# EAGLE schematic sinobit (EAGLE 6.1)
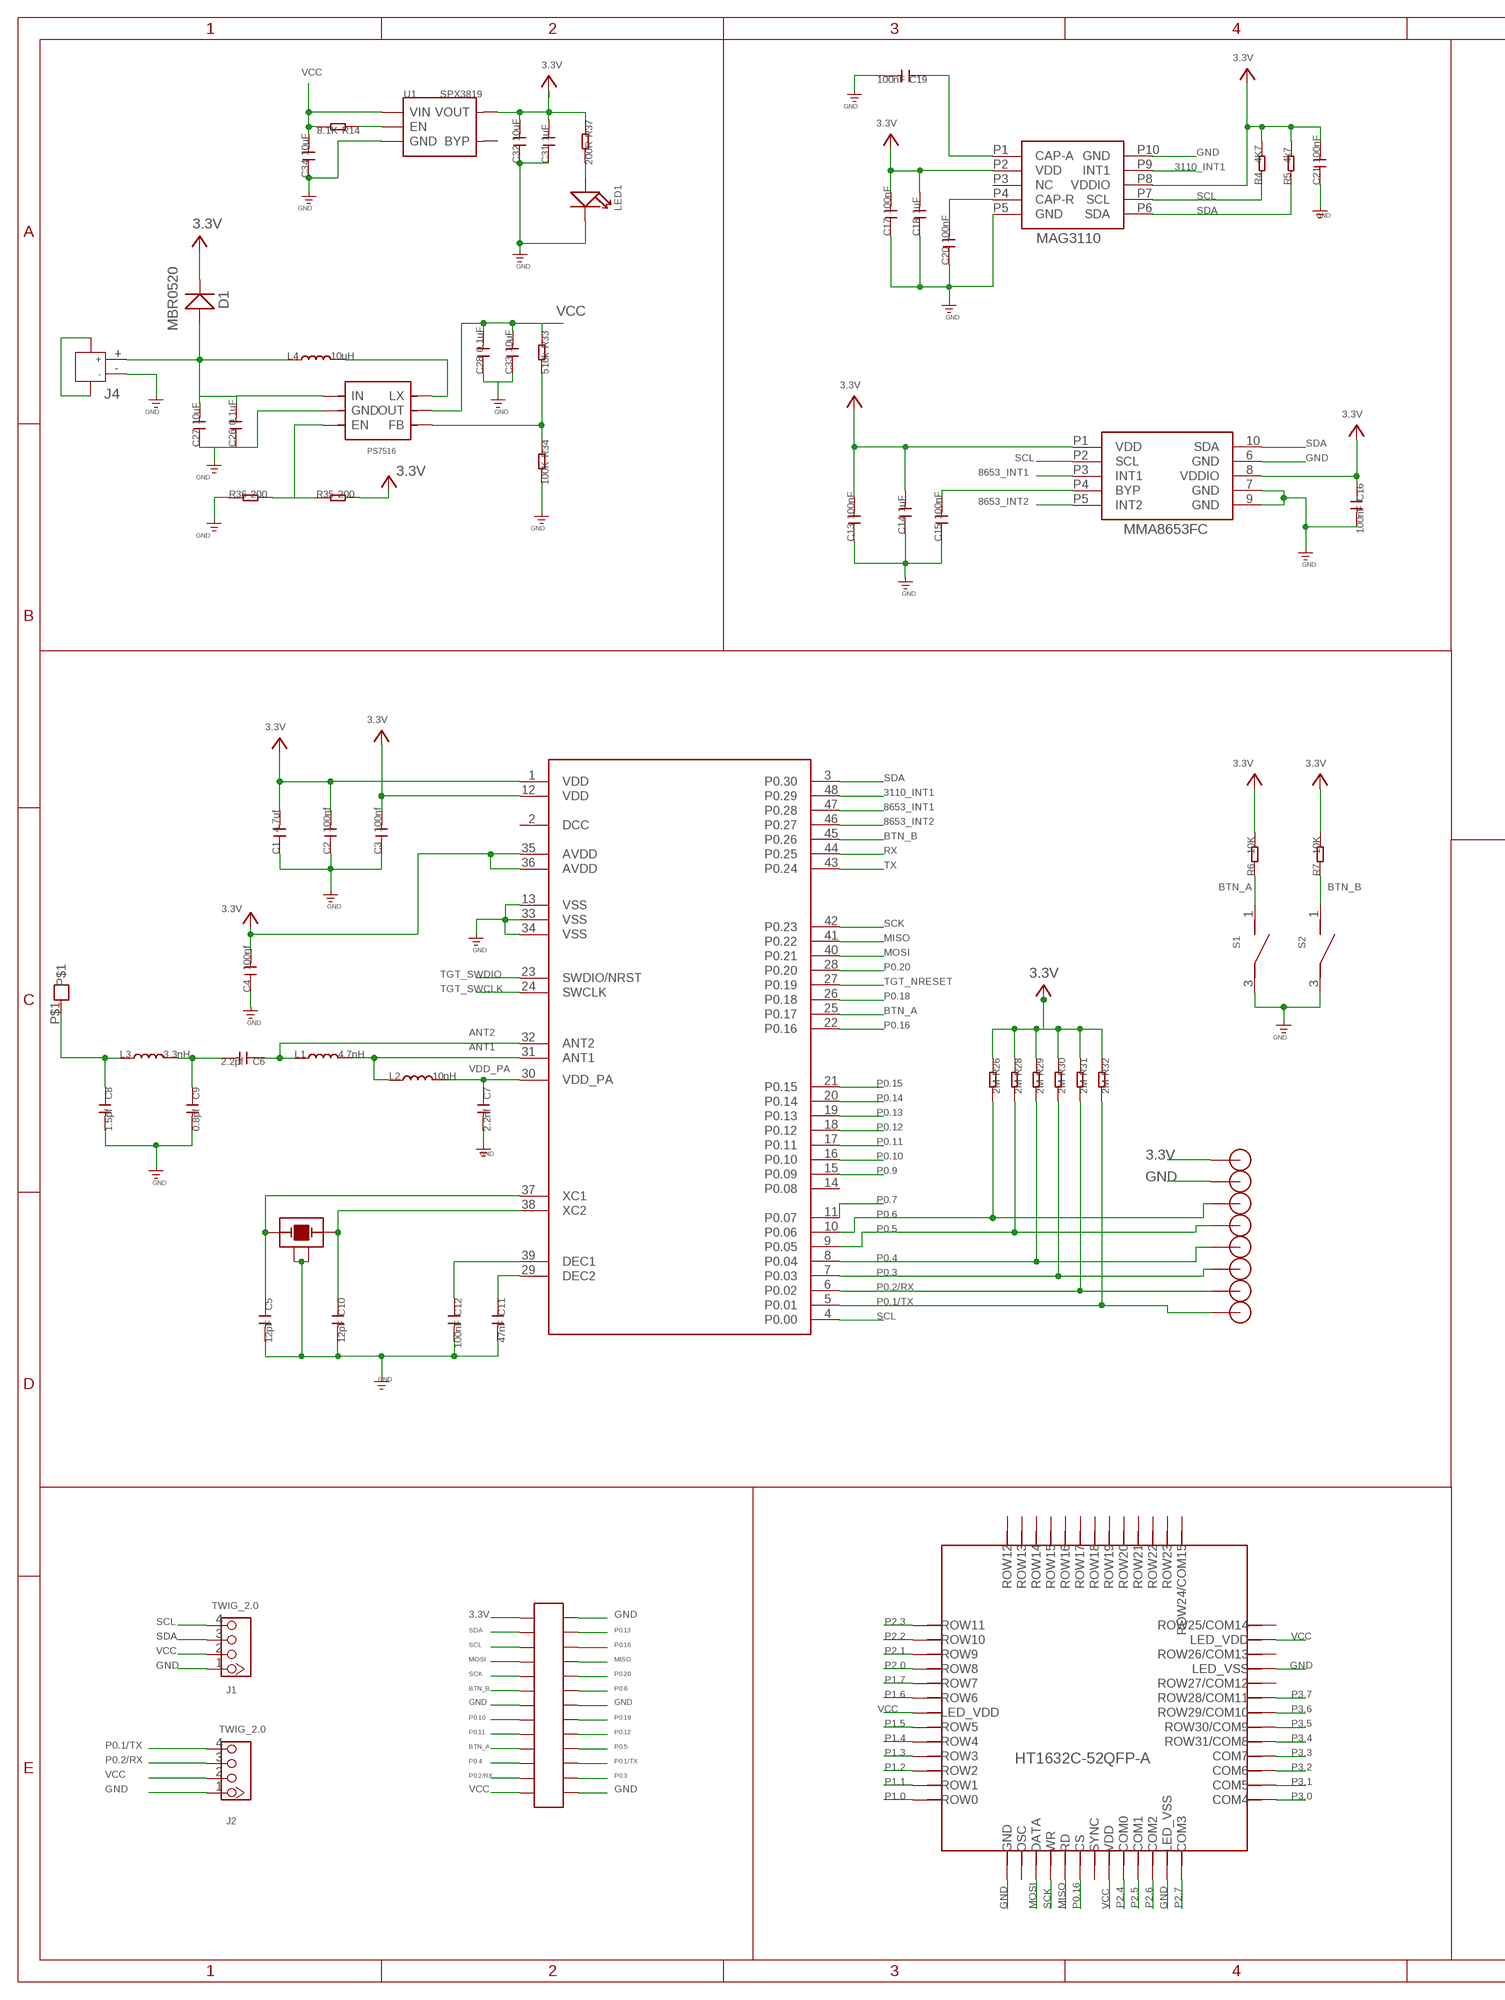
[diagram p0: schematic, sheet 1, part 1 of 2]
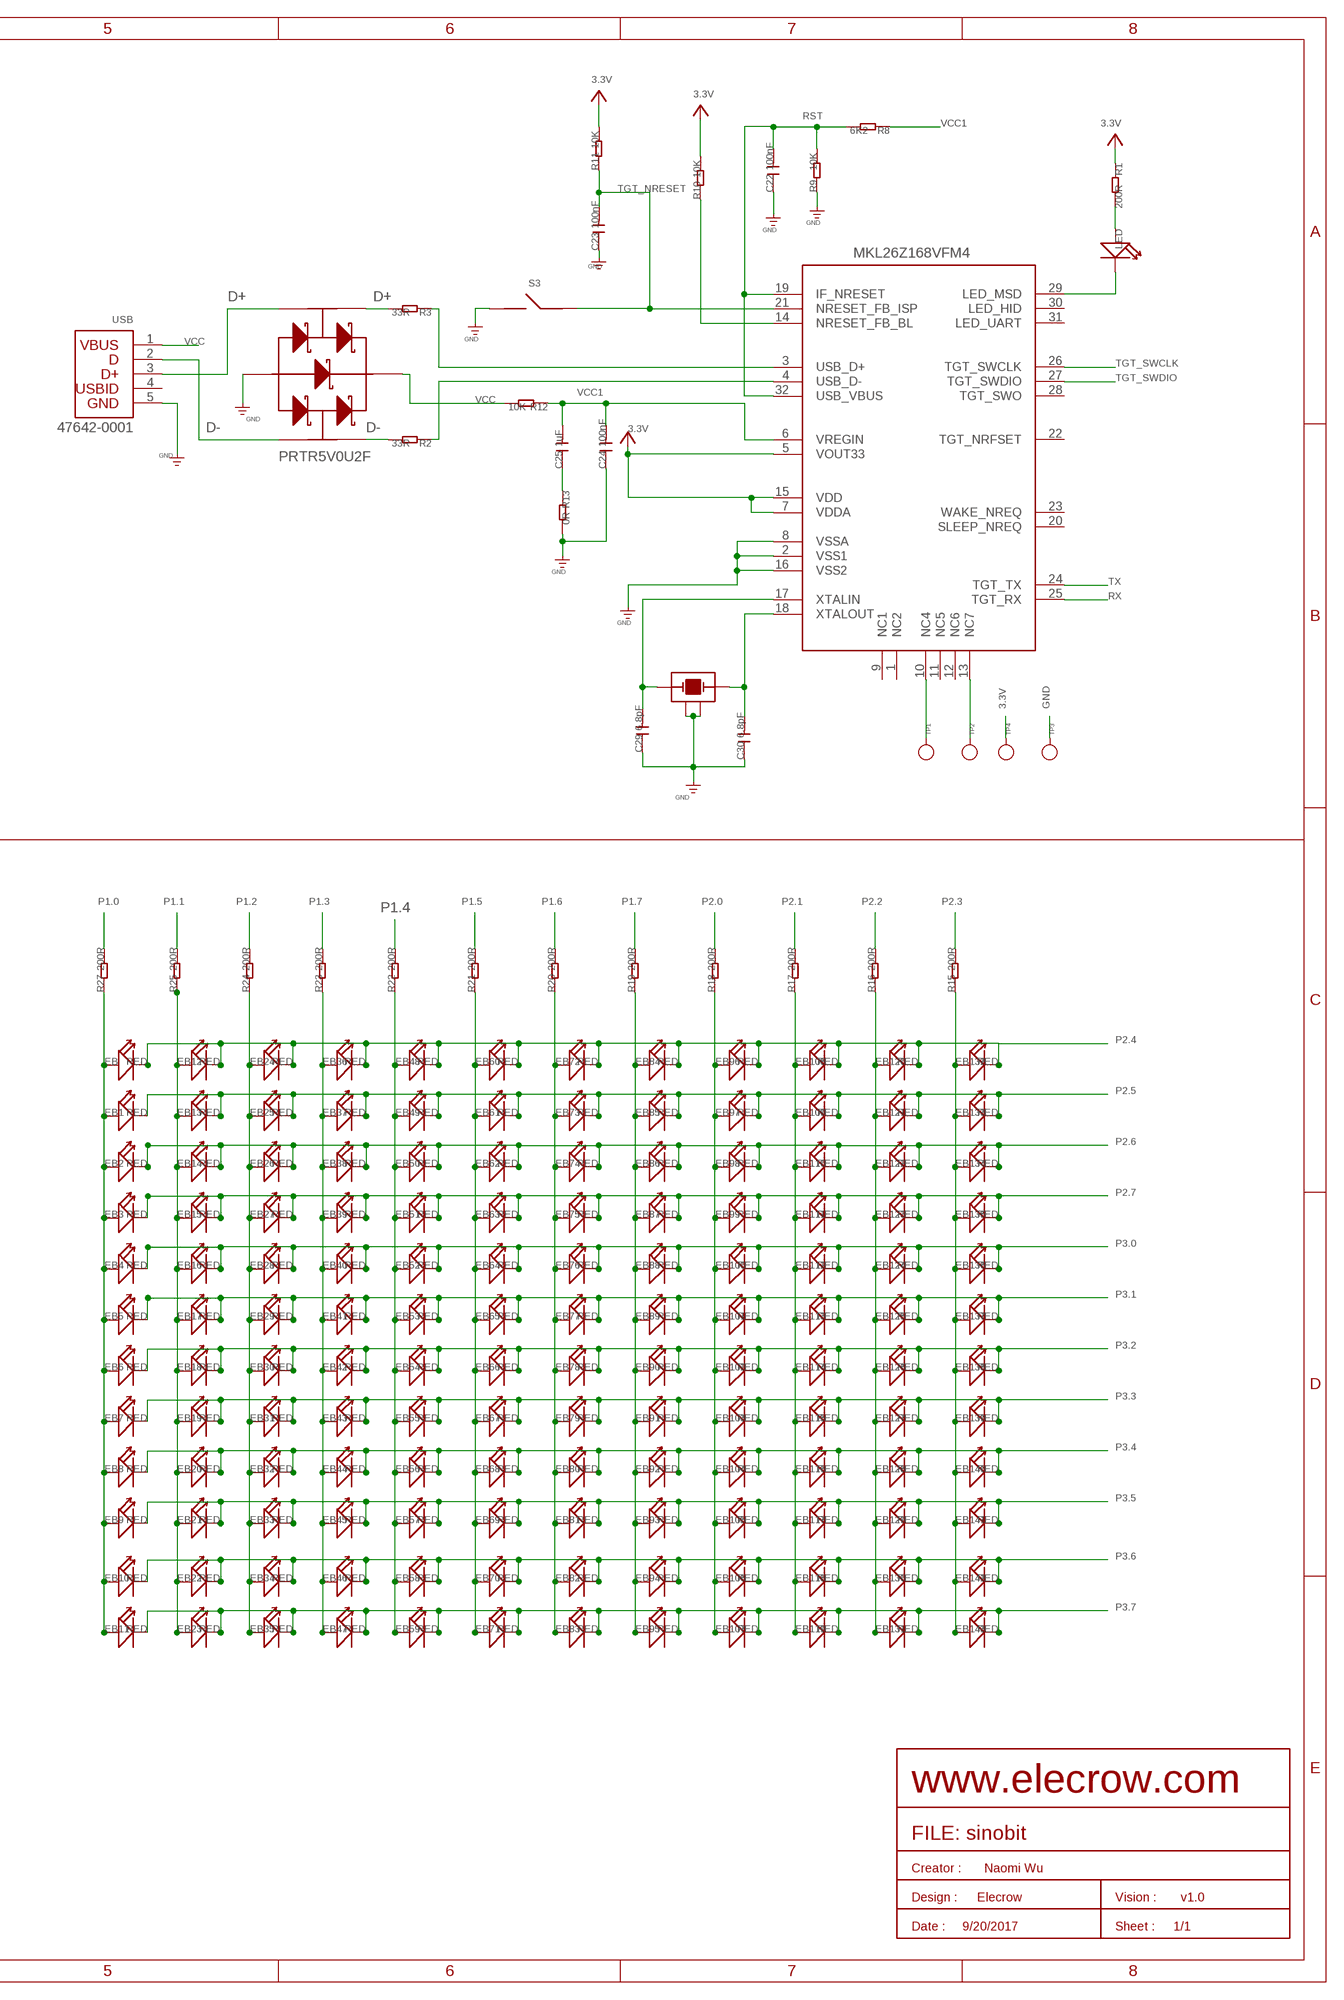
[diagram p1: schematic, sheet 1, part 2 of 2]

## Parts
C1  4.7uf  C-0402  [C0402]
C2  100nf  C-0402  [C0402]
C3  100nf  C-0402  [C0402]
C4  100nf  C-0402  [C0402]
C5  12pF  C-0402  [C0402]
C6  2.2pf  C-0402  [C0402]
C7  2.2nf  C-0402  [C0402]
C8  1.5pf  C-0402  [C0402]
C9  0.8pf  C-0402  [C0402]
C10  12pF  C-0402  [C0402]
C11  47nF  C-0402  [C0402]
C12  100nF  C-0402  [C0402]
C13  100nF  C-0402  [C0402]
C14  1uF  C-0402  [C0402]
C15  100nF  C-0402  [C0402]
C16  100nF  C-0402  [C0402]
C17  100nF  C-0402  [C0402]
C18  1uF  C-0402  [C0402]
C19  100nF  C-0402  [C0402]
C20  100nF  C-0402  [C0402]
C21  100nF  C-0402  [C0402]
C22  100nF  C-0402  [C0402]
C23  100nF  C-0402  [C0402]
C24  100nF  C-0402  [C0402]
C25  1uF  C-0402  [C0402]
C26  0.1uF  C-0402  [C0402]
C27  10uF  C-0402  [C0402]
C28  0.1uF  C-0402  [C0402]
C29  6.8pF  C-0402  [C0402]
C30  6.8pF  C-0402  [C0402]
C31  1uF  C-0402  [C0402]
C32  10uF  C-0402  [C0402]
C33  10uF  C-0402  [C0402]
C34  10uF  C-0402  [C0402]
D1  MBR0520  D'1206'  [SOD123]
EB  RED  007-LED0603  [D0603]
EB1  RED  007-LED0603  [D0603]
EB2  RED  007-LED0603  [D0603]
EB3  RED  007-LED0603  [D0603]
EB4  RED  007-LED0603  [D0603]
EB5  RED  007-LED0603  [D0603]
EB6  RED  007-LED0603  [D0603]
EB7  RED  007-LED0603  [D0603]
EB8  RED  007-LED0603  [D0603]
EB9  RED  007-LED0603  [D0603]
EB10  RED  007-LED0603  [D0603]
EB11  RED  007-LED0603  [D0603]
EB12  RED  007-LED0603  [D0603]
EB13  RED  007-LED0603  [D0603]
EB14  RED  007-LED0603  [D0603]
EB15  RED  007-LED0603  [D0603]
EB16  RED  007-LED0603  [D0603]
EB17  RED  007-LED0603  [D0603]
EB18  RED  007-LED0603  [D0603]
EB19  RED  007-LED0603  [D0603]
EB20  RED  007-LED0603  [D0603]
EB21  RED  007-LED0603  [D0603]
EB22  RED  007-LED0603  [D0603]
EB23  RED  007-LED0603  [D0603]
EB24  RED  007-LED0603  [D0603]
EB25  RED  007-LED0603  [D0603]
EB26  RED  007-LED0603  [D0603]
EB27  RED  007-LED0603  [D0603]
EB28  RED  007-LED0603  [D0603]
EB29  RED  007-LED0603  [D0603]
EB30  RED  007-LED0603  [D0603]
EB31  RED  007-LED0603  [D0603]
EB32  RED  007-LED0603  [D0603]
EB33  RED  007-LED0603  [D0603]
EB34  RED  007-LED0603  [D0603]
EB35  RED  007-LED0603  [D0603]
EB36  RED  007-LED0603  [D0603]
EB37  RED  007-LED0603  [D0603]
EB38  RED  007-LED0603  [D0603]
EB39  RED  007-LED0603  [D0603]
EB40  RED  007-LED0603  [D0603]
EB41  RED  007-LED0603  [D0603]
EB42  RED  007-LED0603  [D0603]
EB43  RED  007-LED0603  [D0603]
EB44  RED  007-LED0603  [D0603]
EB45  RED  007-LED0603  [D0603]
EB46  RED  007-LED0603  [D0603]
EB47  RED  007-LED0603  [D0603]
EB48  RED  007-LED0603  [D0603]
EB49  RED  007-LED0603  [D0603]
EB50  RED  007-LED0603  [D0603]
EB51  RED  007-LED0603  [D0603]
EB52  RED  007-LED0603  [D0603]
EB53  RED  007-LED0603  [D0603]
EB54  RED  007-LED0603  [D0603]
EB55  RED  007-LED0603  [D0603]
EB56  RED  007-LED0603  [D0603]
EB57  RED  007-LED0603  [D0603]
EB58  RED  007-LED0603  [D0603]
EB59  RED  007-LED0603  [D0603]
EB60  RED  007-LED0603  [D0603]
EB61  RED  007-LED0603  [D0603]
EB62  RED  007-LED0603  [D0603]
EB63  RED  007-LED0603  [D0603]
EB64  RED  007-LED0603  [D0603]
EB65  RED  007-LED0603  [D0603]
EB66  RED  007-LED0603  [D0603]
EB67  RED  007-LED0603  [D0603]
EB68  RED  007-LED0603  [D0603]
EB69  RED  007-LED0603  [D0603]
EB70  RED  007-LED0603  [D0603]
EB71  RED  007-LED0603  [D0603]
EB72  RED  007-LED0603  [D0603]
EB73  RED  007-LED0603  [D0603]
EB74  RED  007-LED0603  [D0603]
EB75  RED  007-LED0603  [D0603]
EB76  RED  007-LED0603  [D0603]
EB77  RED  007-LED0603  [D0603]
EB78  RED  007-LED0603  [D0603]
EB79  RED  007-LED0603  [D0603]
EB80  RED  007-LED0603  [D0603]
EB81  RED  007-LED0603  [D0603]
EB82  RED  007-LED0603  [D0603]
EB83  RED  007-LED0603  [D0603]
EB84  RED  007-LED0603  [D0603]
EB85  RED  007-LED0603  [D0603]
EB86  RED  007-LED0603  [D0603]
EB87  RED  007-LED0603  [D0603]
EB88  RED  007-LED0603  [D0603]
EB89  RED  007-LED0603  [D0603]
EB90  RED  007-LED0603  [D0603]
EB91  RED  007-LED0603  [D0603]
EB92  RED  007-LED0603  [D0603]
EB93  RED  007-LED0603  [D0603]
EB94  RED  007-LED0603  [D0603]
EB95  RED  007-LED0603  [D0603]
EB96  RED  007-LED0603  [D0603]
EB97  RED  007-LED0603  [D0603]
EB98  RED  007-LED0603  [D0603]
EB99  RED  007-LED0603  [D0603]
EB100  RED  007-LED0603  [D0603]
EB101  RED  007-LED0603  [D0603]
EB102  RED  007-LED0603  [D0603]
EB103  RED  007-LED0603  [D0603]
EB104  RED  007-LED0603  [D0603]
EB105  RED  007-LED0603  [D0603]
EB106  RED  007-LED0603  [D0603]
EB107  RED  007-LED0603  [D0603]
EB108  RED  007-LED0603  [D0603]
EB109  RED  007-LED0603  [D0603]
EB110  RED  007-LED0603  [D0603]
EB111  RED  007-LED0603  [D0603]
EB112  RED  007-LED0603  [D0603]
EB113  RED  007-LED0603  [D0603]
EB114  RED  007-LED0603  [D0603]
EB115  RED  007-LED0603  [D0603]
EB116  RED  007-LED0603  [D0603]
EB117  RED  007-LED0603  [D0603]
EB118  RED  007-LED0603  [D0603]
EB119  RED  007-LED0603  [D0603]
EB120  RED  007-LED0603  [D0603]
EB121  RED  007-LED0603  [D0603]
EB122  RED  007-LED0603  [D0603]
EB123  RED  007-LED0603  [D0603]
EB124  RED  007-LED0603  [D0603]
EB125  RED  007-LED0603  [D0603]
EB126  RED  007-LED0603  [D0603]
EB127  RED  007-LED0603  [D0603]
EB128  RED  007-LED0603  [D0603]
EB129  RED  007-LED0603  [D0603]
EB130  RED  007-LED0603  [D0603]
EB131  RED  007-LED0603  [D0603]
EB132  RED  007-LED0603  [D0603]
EB133  RED  007-LED0603  [D0603]
EB134  RED  007-LED0603  [D0603]
EB135  RED  007-LED0603  [D0603]
EB136  RED  007-LED0603  [D0603]
EB137  RED  007-LED0603  [D0603]
EB138  RED  007-LED0603  [D0603]
EB139  RED  007-LED0603  [D0603]
EB140  RED  007-LED0603  [D0603]
EB141  RED  007-LED0603  [D0603]
EB142  RED  007-LED0603  [D0603]
EB143  RED  007-LED0603  [D0603]
J1  TWIG_2.0  [2.0_1X4]
J2  TWIG_2.0  [2.0_1X4]
J4  JACK-JST-2P-SMD-PW'2.0'  [JST-SMD-2.0-90D]
L1  4.7nH  L-0603  [L0603]
L2  10nH  L-0603  [L0603]
L3  3.3nH  L-0603  [L0603]
L4  10uH  L-0603  [L0603]
LED  blue  007-LED0603  [D0603]
LED1  green  007-LED0603  [D0603]
R1  200R  R-0402  [R0402]
R2  33R  R-0402  [R0402]
R3  33R  R-0402  [R0402]
R4  4K7  R-0402  [R0402]
R5  4k7  R-0402  [R0402]
R6  10K  R-0402  [R0402]
R7  10K  R-0402  [R0402]
R8  6K2  R-0402  [R0402]
R9  10K  R-0402  [R0402]
R10  10K  R-0402  [R0402]
R11  10K  R-0402  [R0402]
R12  10K  R-0402  [R0402]
R13  0R  R-0402  [R0402]
R14  8.1K  R-0402  [R0402]
R15  200R  R-0402  [R0402]
R16  200R  R-0402  [R0402]
R17  200R  R-0402  [R0402]
R18  200R  R-0402  [R0402]
R19  200R  R-0402  [R0402]
R20  200R  R-0402  [R0402]
R21  200R  R-0402  [R0402]
R22  200R  R-0402  [R0402]
R23  200R  R-0402  [R0402]
R24  200R  R-0402  [R0402]
R25  200R  R-0402  [R0402]
R26  2M  R-0402  [R0402]
R27  200R  R-0402  [R0402]
R28  2M  R-0402  [R0402]
R29  2M  R-0402  [R0402]
R30  2M  R-0402  [R0402]
R31  2M  R-0402  [R0402]
R32  2M  R-0402  [R0402]
R33  510k  R-0402  [R0402]
R34  100K  R-0402  [R0402]
R35  200  R-0402  [R0402]
R36  200  R-0402  [R0402]
R37  200R  R-0402  [R0402]
S1  SWITCH  [SWITCH]
S2  SWITCH  [SWITCH]
S3  SWITCH4.5X4.5  [SWITC4.5X4.5]
TP1  PAD-TEST-POINT'4545'  [TP_4545]
TP2  PAD-TEST-POINT'4545'  [TP_4545]
TP3  PAD-TEST-POINT'4545'  [TP_4545]
TP4  PAD-TEST-POINT'4545'  [TP_4545]
U1  SPX3819  [SOT23-5]
U2  IC_MAG3110FCR1  [MAG3110]
U3  D_ESD_PRTR5V0U2F_115  [PRTR5V0U2F_SOT886]
U6  IC_NRF51822_MODULE  [NRF51822]
U8  HT1632C_QFP52  [HT1632C]
U9  16MHZ2520  [16MHZ2520]
U10  16MHZ2520  [16MHZ2520]
U11  TIANXIAN  [TIANXIAN]
U12  IC_MKL26Z128VFM4  [MKL26Z168VFM4]
U14  IC_MMA8653FCR1  [MMA8653FC]
U16  PS7516  [PS7516]
U$12  26PIN  [26PIN]
U$35  焊盘1  [焊盘1]
U$39  焊盘1  [焊盘1]
U$46  焊盘1  [焊盘1]
U$48  焊盘1  [焊盘1]
U$49  焊盘1  [焊盘1]
U$50  焊盘1  [焊盘1]
U$51  焊盘1  [焊盘1]
U$52  焊盘1  [焊盘1]
USB  47642-0001  [47642-0001]

## Nets
3.3V: C1.2 C2.2 C3.2 C4.2 C13.2 C14.2 C16.1 C17.2 C18.2 C21.2 C31.2 C32.2 D1.- R1.1 R4.2 R5.2 R6.2 R7.2 R10.2 R11.2 R26.1 R28.1 R29.1 R30.1 R31.1 R32.1 R35.2 R37.1 TP4.T U1.5(VOUT) U2.P2(VDD) U2.P8(VDDIO) U6.1(VDD) U6.12(VDD) U6.35(AVDD) U6.36(AVDD) U12.5(VOUT33) U12.7(VDDA) U12.15(VDD) U14.8(VDDIO) U14.P1(VDD) U$12.P$13 U$52.P$1 ; supply symbol labelled VCC
3110_INT1: U2.P9(INT1) U6.48(P0.29)
8653_INT1: U6.47(P0.28) U14.P3(INT1)
8653_INT2: U6.46(P0.27) U14.P5(INT2)
$1: EB1.+ EB2.+ EB3.+ EB4.+ EB5.+ EB6.+ EB7.+ EB8.+ EB9.+ EB10.+ EB11.+ EB.+ R27.1
$2: EB12.+ EB13.+ EB14.+ EB15.+ EB16.+ EB17.+ EB18.+ EB19.+ EB20.+ EB21.+ EB22.+ EB23.+ R25.1
$3: EB24.+ EB25.+ EB26.+ EB27.+ EB28.+ EB29.+ EB30.+ EB31.+ EB32.+ EB33.+ EB34.+ EB35.+ R24.1
$4: EB36.+ EB37.+ EB38.+ EB39.+ EB40.+ EB41.+ EB42.+ EB43.+ EB44.+ EB45.+ EB46.+ EB47.+ R23.1
$5: EB60.+ EB61.+ EB62.+ EB63.+ EB64.+ EB65.+ EB66.+ EB67.+ EB68.+ EB69.+ EB70.+ EB71.+ R21.1
$6: EB72.+ EB73.+ EB74.+ EB75.+ EB76.+ EB77.+ EB78.+ EB79.+ EB80.+ EB81.+ EB82.+ EB83.+ R20.1
$7: EB84.+ EB85.+ EB86.+ EB87.+ EB88.+ EB89.+ EB90.+ EB91.+ EB92.+ EB93.+ EB94.+ EB95.+ R19.1
$8: EB96.+ EB97.+ EB98.+ EB99.+ EB100.+ EB101.+ EB102.+ EB103.+ EB104.+ EB105.+ EB106.+ EB107.+ R18.1
$9: EB108.+ EB109.+ EB110.+ EB111.+ EB112.+ EB113.+ EB114.+ EB115.+ EB116.+ EB117.+ EB118.+ EB119.+ R17.1
$10: EB120.+ EB121.+ EB122.+ EB123.+ EB124.+ EB125.+ EB126.+ EB127.+ EB128.+ EB129.+ EB130.+ EB131.+ R16.1
$12: EB132.+ EB133.+ EB134.+ EB135.+ EB136.+ EB137.+ EB138.+ EB139.+ EB140.+ EB141.+ EB142.+ EB143.+ R15.1
$80: EB48.+ EB49.+ EB50.+ EB51.+ EB52.+ EB53.+ EB54.+ EB55.+ EB56.+ EB57.+ EB58.+ EB59.+ R22.1
ANT1: L1.2 L2.1 U6.31(ANT1)
ANT2: C6.1 L1.1 U6.32(ANT2)
BTN_A: R6.1 S1.1 U6.25(P0.17) U$12.P$4
BTN_B: R7.1 S2.1 U6.45(P0.26) U$12.P$8
D+: R3.2 U3.P3 U3.P4 USB.3
D-: R2.2 U3.P1 U3.P6 USB.2
GND: C1.1 C2.1 C3.1 C4.1 C5.2 C7.2 C8.2 C9.2 C10.2 C11.2 C12.2 C13.1 C14.1 C15.1 C16.2 C17.1 C18.1 C19.2 C20.1 C21.1 C22.1 C23.1 C24.1 C26.1 C27.1 C28.1 C29.1 C30.1 C31.1 C32.1 C33.1 C34.1 J1.1 J2.1 J4.- LED1.- R9.1 R13.2 R34.2 R36.1 S1.3 S2.3 S3.P$1 TP3.T U1.2(GND) U2.P5(GND) U2.P10(GND) U3.P2 U6.13(VSS) U6.33(VSS) U6.34(VSS) U8.P$8(GND) U8.P$19(LED_VSS) U8.P$30(LED_VSS) U9.2 U9.4 U10.2 U10.4 U12.2(VSS1) U12.8(VSSA) U12.16(VSS2) U14.6(GND) U14.7(GND) U14.9(GND) U16.P2(GND) U$12.P$7 U$12.P$14 U$12.P$20 U$12.P$26 U$46.P$1 USB.5
MISO: U6.41(P0.22) U8.P$12(RD) U$12.P$17
MOSI: U6.40(P0.21) U8.P$10(DATA) U$12.P$10
N$1: C20.2 U2.P4(CAP-R)
N$2: C19.1 U2.P1(CAP-A)
N$3: R10.1 U12.14(NRESET_FB_BL)
N$4: C15.2 U14.P4(BYP)
N$5: LED1.+ R37.2
N$6: LED.+ R1.2
N$8: TP1.T U12.10(NC4)
N$9: TP2.T U12.13(NC7)
N$11: LED.- U12.29(LED_MSD)
N$12: C25.1 R13.1
N$13: J4.3 J4.4
N$14: R3.1 U12.3(USB_D+)
N$15: R2.1 U12.4(USB_D-)
N$16: C29.2 U10.1 U12.17(XTALIN)
N$17: C30.2 U10.3 U12.18(XTALOUT)
N$18: R35.1 R36.2 U16.P4(EN)
N$19: C26.2 C27.2 D1.+ J4.+ L4.1 U16.P6(IN)
N$20: C6.2 C9.1 L3.2
N$21: R14.1 U1.3(EN)
N$22: L4.2 U16.P1(LX)
N$23: C8.1 L3.1 U11.P$1
N$24: C5.1 U6.37(XC1) U9.1
N$26: R33.2 R34.1 U16.P3(FB)
N$29: C10.1 U6.38(XC2) U9.3
N$30: C11.1 U6.29(DEC2)
N$31: C12.1 U6.39(DEC1)
P0.1/TX: J2.4 R32.2 U6.5(P0.01) U$12.P$24 U$39.P$1
P0.2/RX: J2.3 R31.2 U6.6(P0.02) U$12.P$2 U$35.P$1
P0.3: R30.2 U6.7(P0.03) U$12.P$25 U$51.P$1
P0.4: R29.2 U6.8(P0.04) U$12.P$3 U$50.P$1
P0.5: R28.2 U6.9(P0.05) U$12.P$23 U$49.P$1
P0.6: R26.2 U6.10(P0.06) U$12.P$19 U$48.P$1
P0.7: U6.11(P0.07)
P0.9: U6.15(P0.09)
P0.10: U6.16(P0.10) U$12.P$6
P0.11: U6.17(P0.11) U$12.P$5
P0.12: U6.18(P0.12) U$12.P$22
P0.13: U6.19(P0.13) U$12.P$15
P0.14: U6.20(P0.14)
P0.15: U6.21(P0.15)
P0.16: U6.22(P0.16) U8.P$13(CS) U$12.P$16
P0.18: U6.26(P0.18) U$12.P$21
P0.20: U6.28(P0.20) U$12.P$18
P1.0: R27.2 U8.P$47(ROW0)
P1.1: R25.2 U8.P$48(ROW1)
P1.2: R24.2 U8.P$49(ROW2)
P1.3: R23.2 U8.P$50(ROW3)
P1.4: R22.2 U8.P$51(ROW4)
P1.5: R21.2 U8.P$52(ROW5)
P1.6: R20.2 U8.P$54(ROW6)
P1.7: R19.2 U8.P$55(ROW7)
P2.0: R18.2 U8.P$56(ROW8)
P2.1: R17.2 U8.P$57(ROW9)
P2.2: R16.2 U8.P$58(ROW10)
P2.3: R15.2 U8.P$59(ROW11)
P2.4: EB12.- EB24.- EB36.- EB48.- EB60.- EB72.- EB84.- EB96.- EB108.- EB120.- EB132.- EB.- U8.P$16(COM0)
P2.5: EB1.- EB13.- EB25.- EB37.- EB49.- EB61.- EB73.- EB85.- EB97.- EB109.- EB121.- EB133.- U8.P$17(COM1)
P2.6: EB2.- EB14.- EB26.- EB38.- EB50.- EB62.- EB74.- EB86.- EB98.- EB110.- EB122.- EB134.- U8.P$18(COM2)
P2.7: EB3.- EB15.- EB27.- EB39.- EB51.- EB63.- EB75.- EB87.- EB99.- EB111.- EB123.- EB135.- U8.P$20(COM3)
P3.0: EB4.- EB16.- EB28.- EB40.- EB52.- EB64.- EB76.- EB88.- EB100.- EB112.- EB124.- EB136.- U8.P$21(COM4)
P3.1: EB5.- EB17.- EB29.- EB41.- EB53.- EB65.- EB77.- EB89.- EB101.- EB113.- EB125.- EB137.- U8.P$22(COM5)
P3.2: EB6.- EB18.- EB30.- EB42.- EB54.- EB66.- EB78.- EB90.- EB102.- EB114.- EB126.- EB138.- U8.P$23(COM6)
P3.3: EB7.- EB19.- EB31.- EB43.- EB55.- EB67.- EB79.- EB91.- EB103.- EB115.- EB127.- EB139.- U8.P$24(COM7)
P3.4: EB8.- EB20.- EB32.- EB44.- EB56.- EB68.- EB80.- EB92.- EB104.- EB116.- EB128.- EB140.- U8.P$25(ROW31/COM8)
P3.5: EB9.- EB21.- EB33.- EB45.- EB57.- EB69.- EB81.- EB93.- EB105.- EB117.- EB129.- EB141.- U8.P$26(ROW30/COM9)
P3.6: EB10.- EB22.- EB34.- EB46.- EB58.- EB70.- EB82.- EB94.- EB106.- EB118.- EB130.- EB142.- U8.P$27(ROW29/COM10)
P3.7: EB11.- EB23.- EB35.- EB47.- EB59.- EB71.- EB83.- EB95.- EB107.- EB119.- EB131.- EB143.- U8.P$28(ROW28/COM11)
RST: C22.2 R8.2 R9.2 U12.19(IF_NRESET) U12.32(USB_VBUS)
RX: U6.44(P0.25) U12.25(TGT_RX)
SCK: U6.42(P0.23) U8.P$11(WR) U$12.P$9
SCL: J1.4 R4.1 U2.P7(SCL) U6.4(P0.00) U14.P2(SCL) U$12.P$11
SDA: J1.3 R5.1 U2.P6(SDA) U6.3(P0.30) U14.10(SDA) U$12.P$12
TGT_NRESET: C23.2 R11.1 S3.P$2 U6.27(P0.19) U12.21(NRESET_FB_ISP)
TGT_SWCLK: U6.24(SWCLK) U12.26(TGT_SWCLK)
TGT_SWDIO: U6.23(SWDIO/NRST) U12.27(TGT_SWDIO)
TX: U6.43(P0.24) U12.24(TGT_TX)
VCC: C28.2 C33.2 C34.2 J1.2 J2.2 R12.2 R14.2 R33.1 U1.1(VIN) U3.P5 U8.P$15(VDD) U8.P$32(LED_VDD) U8.P$53(LED_VDD) U16.P5(OUT) U$12.P$1 USB.1
VCC1: C24.2 C25.2 R8.1 R12.1 U12.6(VREGIN)
VDD_PA: C7.1 L2.2 U6.30(VDD_PA)
Unconnected: U1.4(BYP) U2.P3(NC) U6.2(DCC) U6.14(P0.08) U8.P$9(OSC) U8.P$14(SYNC) U8.P$29(ROW27/COM12) U8.P$31(ROW26/COM13) U8.P$33(ROW25/COM14) U8.P$34(ROW12) U8.P$35(ROW13) U8.P$36(ROW14) U8.P$37(ROW15) U8.P$38(ROW16) U8.P$39(ROW17) U8.P$40(ROW18) U8.P$41(ROW19) U8.P$42(ROW20) U8.P$43(ROW21) U8.P$44(ROW22) U8.P$45(ROW23) U8.P$46(ROW24/COM15) U12.1(NC2) U12.9(NC1) U12.11(NC5) U12.12(NC6) U12.20(SLEEP_NREQ) U12.22(TGT_NRFSET) U12.23(WAKE_NREQ) U12.28(TGT_SWO) U12.30(LED_HID) U12.31(LED_UART) USB.4

## Notes on the sheet
- S3
- S1 | S2
- www.elecrow.com
- FILE: sinobit
- Creator : | Naomi Wu
- Design : | Elecrow | Vision : | v1.0
- Date : | 9/20/2017 | Sheet : | 1/1

## Library data of the parts
C1-C34 = Discrete:C*: Ceramic Capacitors
D1 = Discrete:D*
EB EB1-EB143 LED LED1 = Discrete:007-LED*
J1 J2 = CONNECTER:TWIG_2.0
J4 = Connector:JACK-JST-2P-SMD-PW
L1-L4 = OPL Eagle Library:L*
R1-R37 = Discrete:R*
S1 S2 = microbit2:SWITCH
S3 = microbit2:SWITCH4.5X4.5
TP1-TP4 = Discrete:PAD-TEST-POINT; PARTNO: DNP
U1 = IC:SPX3819
U2 = mirco：bit:IC_MAG3110FCR1
U3 = Modulebit_open_Eagle:D_ESD_PRTR5V0U2F_115
U6 = mirco：bit:IC_NRF51822_MODULE
U8 = microbit2:HT1632C_QFP52
U9 U10 = Modulebit_open_Eagle:16MHZ2520
U11 = microbit2:TIANXIAN
U12 = Modulebit_open_Eagle:IC_MKL26Z128VFM4
U14 = mirco：bit:IC_MMA8653FCR1
U16 = microbit2:PS7516
U$12 = microbit2:26PIN
U$35 U$39 U$46 U$48-U$52 = mirco：bit:焊盘1
USB = Calliope:47642-0001

## Net classes
0 default: width 0.003 mm, drill 0.254 mm, clearance 0.152 mm